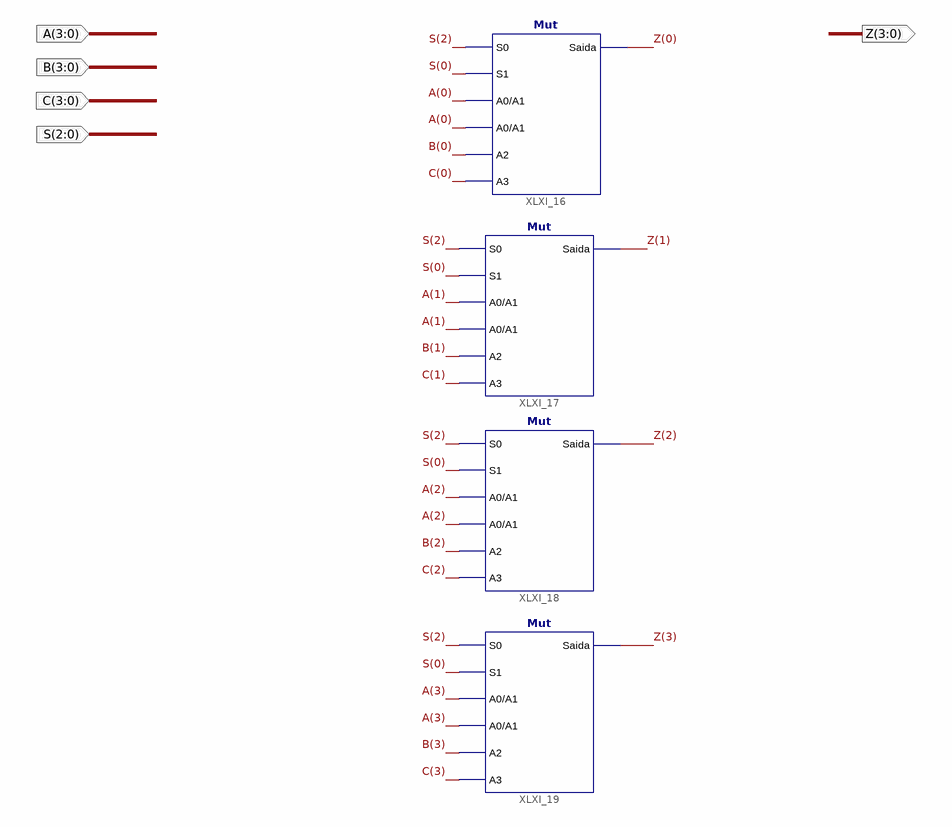
[diagram p0: schematic sheet 1]
// Xilinx ISE schematic Mux41.sch (xa9500xl) as structural Verilog: 4 symbols, 5 ports
module Mux41 (
  input  [3:0] A,
  input  [3:0] B,
  input  [3:0] C,
  input  [2:0] S,
  output [3:0] Z
);

  Mut XLXI_16 (.S0(S[2]), .S1(S[0]), .A0(A[0]), .A1(A[0]), .A2(B[0]), .A3(C[0]), .Saida(Z[0]));
  Mut XLXI_17 (.S0(S[2]), .S1(S[0]), .A0(A[1]), .A1(A[1]), .A2(B[1]), .A3(C[1]), .Saida(Z[1]));
  Mut XLXI_18 (.S0(S[2]), .S1(S[0]), .A0(A[2]), .A1(A[2]), .A2(B[2]), .A3(C[2]), .Saida(Z[2]));
  Mut XLXI_19 (.S0(S[2]), .S1(S[0]), .A0(A[3]), .A1(A[3]), .A2(B[3]), .A3(C[3]), .Saida(Z[3]));
endmodule
